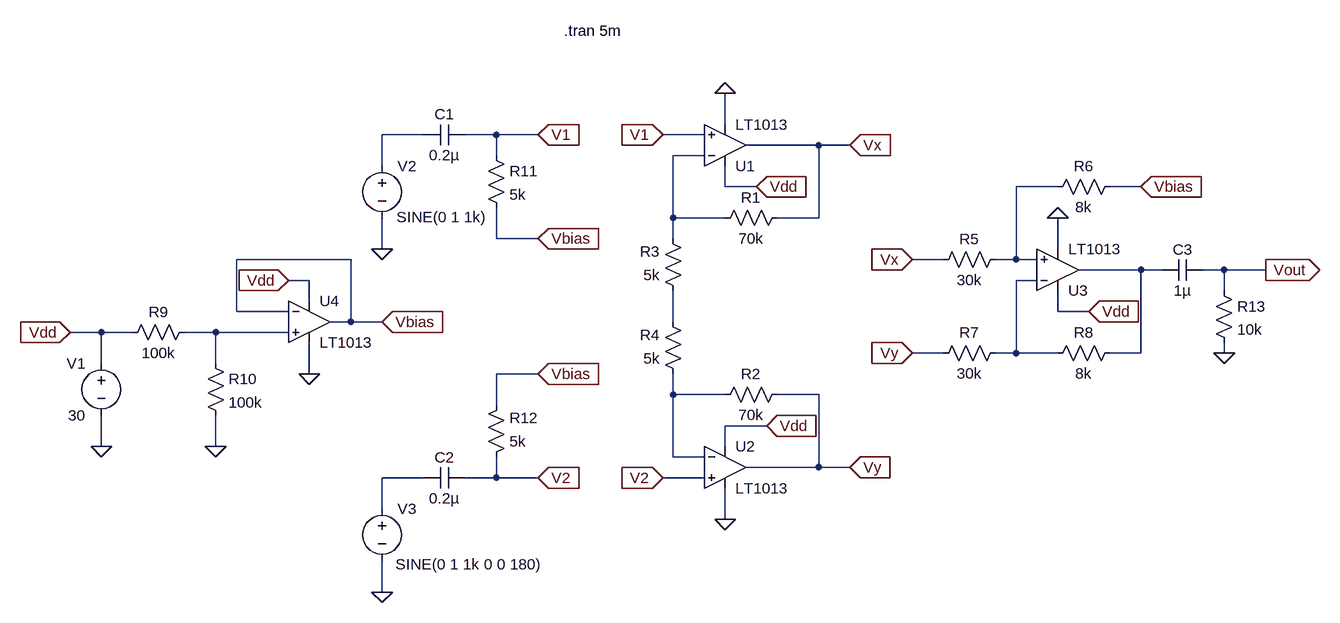
[diagram p0: schematic Q2_Implementation.asc]
Q2_Implementation.asc, the LTspice schematic file:
Version 4
SHEET 1 1252 768
WIRE 304 32 304 -16
WIRE -160 48 -224 48
WIRE -48 48 -96 48
WIRE 16 48 -48 48
WIRE 272 48 208 48
WIRE 448 64 336 64
WIRE 496 64 448 64
WIRE -48 80 -48 48
WIRE 272 80 224 80
WIRE -224 96 -224 48
WIRE 304 128 304 96
WIRE 352 128 304 128
WIRE 816 128 752 128
WIRE 944 128 896 128
WIRE 224 176 224 80
WIRE 304 176 224 176
WIRE 448 176 448 64
WIRE 448 176 384 176
WIRE -48 208 -48 160
WIRE 16 208 -48 208
WIRE 224 208 224 176
WIRE -224 224 -224 176
WIRE 816 224 816 176
WIRE -272 240 -448 240
WIRE 640 240 592 240
WIRE 752 240 752 128
WIRE 752 240 720 240
WIRE 784 240 752 240
WIRE 944 256 848 256
WIRE 976 256 944 256
WIRE 1072 256 1040 256
WIRE 1136 256 1072 256
WIRE -336 272 -368 272
WIRE 784 272 752 272
WIRE 1072 288 1072 256
WIRE -336 304 -336 272
WIRE -448 320 -448 240
WIRE -368 320 -448 320
WIRE 816 320 816 288
WIRE 864 320 816 320
WIRE -272 336 -272 240
WIRE -272 336 -304 336
WIRE -224 336 -272 336
WIRE 224 336 224 288
WIRE -656 352 -704 352
WIRE -608 352 -656 352
WIRE -480 352 -528 352
WIRE -368 352 -480 352
WIRE 640 384 592 384
WIRE 752 384 752 272
WIRE 752 384 720 384
WIRE 816 384 752 384
WIRE 944 384 944 256
WIRE 944 384 896 384
WIRE 1072 384 1072 368
WIRE -656 400 -656 352
WIRE -480 400 -480 352
WIRE -336 416 -336 368
WIRE 16 416 -48 416
WIRE 224 448 224 416
WIRE 304 448 224 448
WIRE 448 448 384 448
WIRE -48 464 -48 416
WIRE 368 496 304 496
WIRE -656 528 -656 480
WIRE -480 528 -480 480
WIRE 304 528 304 496
WIRE 224 544 224 448
WIRE 272 544 224 544
WIRE 448 560 448 448
WIRE 448 560 336 560
WIRE 496 560 448 560
WIRE -160 576 -224 576
WIRE -48 576 -48 544
WIRE -48 576 -96 576
WIRE 16 576 -48 576
WIRE 272 576 208 576
WIRE -224 624 -224 576
WIRE 304 640 304 592
WIRE -224 752 -224 704
FLAG 208 48 V1
IOPIN 208 48 In
FLAG 208 576 V2
IOPIN 208 576 In
FLAG 304 -16 0
FLAG 304 640 0
FLAG 368 496 Vdd
IOPIN 368 496 In
FLAG 352 128 Vdd
IOPIN 352 128 In
FLAG 496 64 Vx
IOPIN 496 64 In
FLAG 496 560 Vy
IOPIN 496 560 In
FLAG 1136 256 Vout
IOPIN 1136 256 Out
FLAG 592 240 Vx
IOPIN 592 240 In
FLAG 592 384 Vy
IOPIN 592 384 In
FLAG 816 176 0
FLAG 864 320 Vdd
IOPIN 864 320 In
FLAG -656 528 0
FLAG -480 528 0
FLAG -336 416 0
FLAG -704 352 Vdd
IOPIN -704 352 In
FLAG -224 336 Vbias
IOPIN -224 336 In
FLAG -368 272 Vdd
IOPIN -368 272 In
FLAG 944 128 Vbias
IOPIN 944 128 In
FLAG -224 224 0
FLAG -224 752 0
FLAG 16 48 V1
IOPIN 16 48 In
FLAG 16 576 V2
IOPIN 16 576 In
FLAG 16 208 Vbias
IOPIN 16 208 In
FLAG 16 416 Vbias
IOPIN 16 416 In
FLAG 1072 384 0
SYMBOL opamps/LT1013 304 128 M180
SYMATTR InstName U1
SYMBOL opamps/LT1013 304 496 R0
SYMATTR InstName U2
SYMBOL opamps/LT1013 816 320 M180
SYMATTR InstName U3
SYMBOL res 400 160 R90
WINDOW 0 0 56 VBottom 2
WINDOW 3 32 56 VTop 2
SYMATTR InstName R1
SYMATTR Value 70k
SYMBOL res 400 432 R90
WINDOW 0 0 56 VBottom 2
WINDOW 3 32 56 VTop 2
SYMATTR InstName R2
SYMATTR Value 70k
SYMBOL res 240 304 R180
WINDOW 0 36 76 Left 2
WINDOW 3 36 40 Left 2
SYMATTR InstName R3
SYMATTR Value 5k
SYMBOL res 240 432 R180
WINDOW 0 36 76 Left 2
WINDOW 3 36 40 Left 2
SYMATTR InstName R4
SYMATTR Value 5k
SYMBOL res 736 224 R90
WINDOW 0 0 56 VBottom 2
WINDOW 3 32 56 VTop 2
SYMATTR InstName R5
SYMATTR Value 30k
SYMBOL res 912 112 R90
WINDOW 0 0 56 VBottom 2
WINDOW 3 32 56 VTop 2
SYMATTR InstName R6
SYMATTR Value 8k
SYMBOL res 736 368 R90
WINDOW 0 0 56 VBottom 2
WINDOW 3 32 56 VTop 2
SYMATTR InstName R7
SYMATTR Value 30k
SYMBOL res 912 368 R90
WINDOW 0 0 56 VBottom 2
WINDOW 3 32 56 VTop 2
SYMATTR InstName R8
SYMATTR Value 8k
SYMBOL voltage -656 384 M0
SYMATTR InstName V1
SYMATTR Value 30
SYMBOL res -624 368 R270
WINDOW 0 32 56 VTop 2
WINDOW 3 0 56 VBottom 2
SYMATTR InstName R9
SYMATTR Value 100k
SYMBOL res -496 384 R0
SYMATTR InstName R10
SYMATTR Value 100k
SYMBOL opamps/LT1013 -336 272 R0
SYMATTR InstName U4
SYMBOL cap -96 32 R90
WINDOW 0 0 32 VBottom 2
WINDOW 3 32 32 VTop 2
SYMATTR InstName C1
SYMATTR Value 0.2µ
SYMBOL cap -96 560 R90
WINDOW 0 0 32 VBottom 2
WINDOW 3 32 32 VTop 2
SYMATTR InstName C2
SYMATTR Value 0.2µ
SYMBOL res -64 64 R0
SYMATTR InstName R11
SYMATTR Value 5k
SYMBOL res -64 560 M180
WINDOW 0 36 76 Left 2
WINDOW 3 36 40 Left 2
SYMATTR InstName R12
SYMATTR Value 5k
SYMBOL res 1056 272 R0
SYMATTR InstName R13
SYMATTR Value 10k
SYMBOL cap 1040 240 R90
WINDOW 0 0 32 VBottom 2
WINDOW 3 32 32 VTop 2
SYMATTR InstName C3
SYMATTR Value 1µ
SYMBOL voltage -224 80 R0
WINDOW 3 22 95 Left 2
SYMATTR Value SINE(0 1 1k)
SYMATTR InstName V2
SYMBOL voltage -224 608 R0
WINDOW 3 21 101 Left 2
SYMATTR Value SINE(0 1 1k 0 0 180)
SYMATTR InstName V3
TEXT 56 -112 Left 2 !.tran 5m

The netlist it stands for:
* Q2_Implementation.asc
XU1 V1 N002 Vdd 0 Vx LT1013  ; pins In+ In- V+ V- OUT
XU2 V2 N008 Vdd 0 Vy LT1013  ; pins In+ In- V+ V- OUT
XU3 N003 N005 Vdd 0 N004 LT1013  ; pins In+ In- V+ V- OUT
R1 Vx N002 70k
R2 Vy N008 70k
R3 N006 N002 5k
R4 N008 N006 5k
R5 N003 Vx 30k
R6 Vbias N003 8k
R7 N005 Vy 30k
R8 N004 N005 8k
V1 Vdd 0 30
R9 Vdd N007 100k
R10 N007 0 100k
XU4 N007 Vbias Vdd 0 Vbias LT1013  ; pins In+ In- V+ V- OUT
C1 V1 N001 0.2µ
C2 V2 N009 0.2µ
R11 V1 Vbias 5k
R12 V2 Vbias 5k
R13 Vout 0 10k
C3 Vout N004 1µ
V2 N001 0 SINE(0 1 1k)
V3 N009 0 SINE(0 1 1k 0 0 180)
.tran 5m
.lib LTC.lib
.backanno
.end